# Altium schematic sheet Sheet_2_2022-11-04.schdoc
size 214 x 181 mm
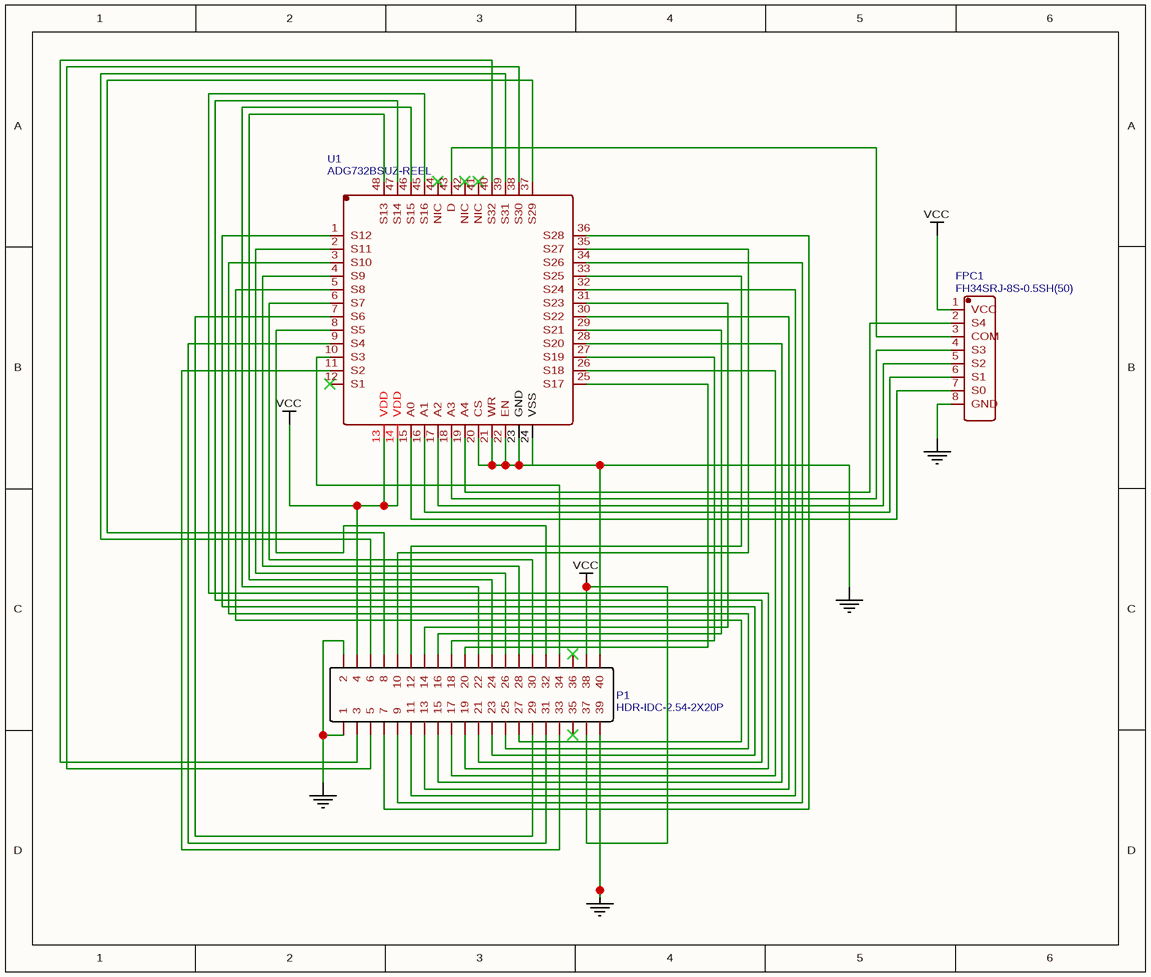
[diagram p0: Sheet_2_2022-11-04.schdoc]

## Parts
FPC1  FH34SRJ-8S-0.5SH(50)  [FPC-0.5MM-LSSJ-H2.0-8P]
P1  HDR-IDC-2.54-2X20P  [HDR-IDC-2.54-2X20P]
U1  ADG732BSUZ-REEL  [TQFP-48_7X7X05P]

## Nets
GND: FPC1.8(GND) P1.1 P1.2 P1.39 P1.40 U1.20(CS) U1.21(WR) U1.22(EN) U1.23(GND) U1.24(VSS)
VCC: FPC1.1(VCC) P1.4 P1.37 P1.38 U1.13(VDD) U1.14(VDD)
NetFPC1_2: FPC1.2(S4) U1.19(A4)
NetFPC1_3: FPC1.3(COM) U1.43(D)
NetFPC1_4: FPC1.4(S3) U1.18(A3)
NetFPC1_5: FPC1.5(S2) U1.17(A2)
NetFPC1_6: FPC1.6(S1) U1.16(A1)
NetFPC1_7: FPC1.7(S0) U1.15(A0)
NetP1_3: P1.3 U1.40(S32)
NetP1_5: P1.5 U1.38(S30)
NetP1_6: P1.6 U1.39(S31)
NetP1_7: P1.7 U1.36(S28)
NetP1_8: P1.8 U1.37(S29)
NetP1_9: P1.9 U1.34(S26)
NetP1_10: P1.10 U1.35(S27)
NetP1_11: P1.11 U1.32(S24)
NetP1_12: P1.12 U1.33(S25)
NetP1_13: P1.13 U1.30(S22)
NetP1_14: P1.14 U1.31(S23)
NetP1_15: P1.15 U1.28(S20)
NetP1_16: P1.16 U1.29(S21)
NetP1_17: P1.17 U1.26(S18)
NetP1_18: P1.18 U1.27(S19)
NetP1_19: P1.19 U1.45(S16)
NetP1_20: P1.20 U1.25(S17)
NetP1_21: P1.21 U1.47(S14)
NetP1_22: P1.22 U1.46(S15)
NetP1_23: P1.23 U1.1(S12)
NetP1_24: P1.24 U1.48(S13)
NetP1_25: P1.25 U1.3(S10)
NetP1_26: P1.26 U1.2(S11)
NetP1_27: P1.27 U1.5(S8)
NetP1_28: P1.28 U1.4(S9)
NetP1_29: P1.29 U1.7(S6)
NetP1_30: P1.30 U1.6(S7)
NetP1_31: P1.31 U1.9(S4)
NetP1_32: P1.32 U1.8(S5)
NetP1_33: P1.33 U1.11(S2)
NetP1_34: P1.34 U1.10(S3)

Not connected (* = marked no-connect by the designer): P1 35* 36*; U1 12(S1)* 41(NIC)* 42(NIC)* 44(NIC)*

## Library data of the parts
FPC1 = FH34SRJ-8S-0.5SH(50): BOM_Manufacturer: HRS; Contributor: LCSC; BOM_Supplier: LCSC; BOM_Manufacturer Part: FH34SRJ-8S-0.5SH(50); spicePre: F; BOM_Supplier Part: C88372
P1 = HDR-IDC-2.54-2X20P: BOM_Manufacturer: BOOMELE; BOM_Manufacturer Part: IDC Box 2X20 2.54MM; BOM_Supplier: LCSC; image: //image.lceda.cn/szlcsc/C9138.jpg; BOM_Supplier Part: C9138; spicePre: P
U1 = ADG732BSUZ-REEL: BOM_Manufacturer: Analog Devices; Contributor: LCSC; BOM_Supplier: LCSC; BOM_Supplier Part: C114845; BOM_Manufacturer Part: ADG732BSUZ-REEL; spicePre: U